# EAGLE design CCM0006 (EAGLE 6.5.0)
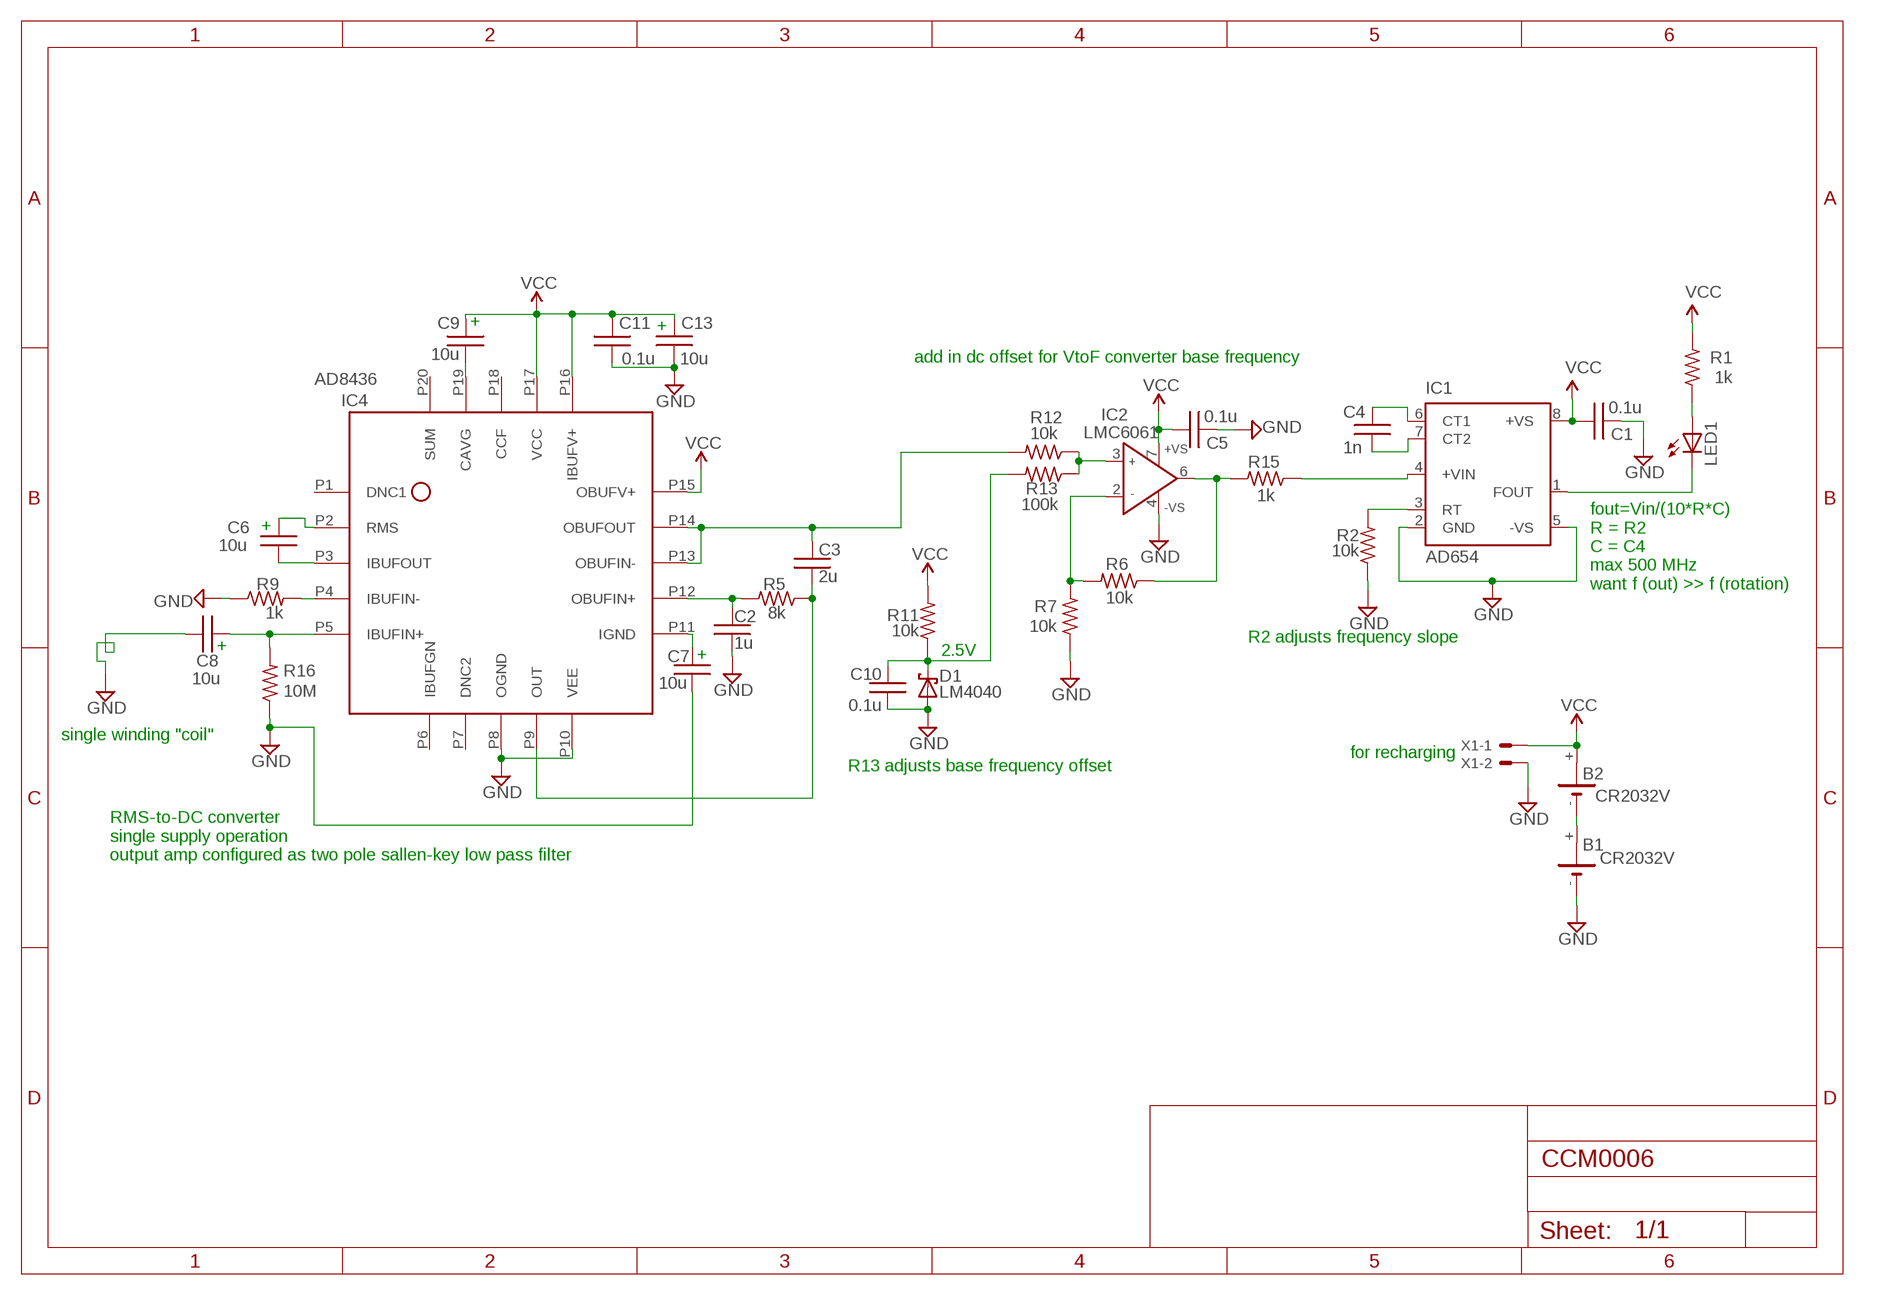
[diagram p0: schematic, sheet 1]

## Parts
B1  CR2032V  [CR2032V]
B2  CR2032V  [CR2032V]
C1  0.1u  CAPACITOR0402  [0402]
C2  1u  CAPACITOR0402  [0402]
C3  2u  CAPACITOR0402  [0402]
C4  1n  CAPACITOR0402  [0402]
C5  0.1u  CAPACITOR0402  [0402]
C6  10u  CAPACITOR0805  [0805]
C7  10u  CAPACITOR0805  [0805]
C8  10u  CAPACITOR0805  [0805]
C9  10u  CAPACITOR0805  [0805]
C10  0.1u  CAPACITOR0402  [0402]
C11  0.1u  CAPACITOR0402  [0402]
C13  10u  CAPACITOR0805  [0805]
D1  LM4040  [SOT23]
IC1  AD654  [SO08]
IC2  LMC6061  AD820R  [SO8]
IC4  AD8436  [CP-20-10]
LED1  LED3MM  [LED3MM]
R1  1k  RESISTOR0402  [0402]
R2  10k  RESISTOR0402  [0402]
R5  8k  RESISTOR0402  [0402]
R6  10k  RESISTOR0402  [0402]
R7  10k  RESISTOR0402  [0402]
R9  1k  RESISTOR0402  [0402]
R11  10k  RESISTOR0402  [0402]
R12  10k  RESISTOR0402  [0402]
R13  100k  RESISTOR0402  [0402]
R15  1k  RESISTOR0402  [0402]
R16  10M  RESISTOR0402  [0402]
X1  22-23-2021  [22-23-2021]

## Nets
AGND: B1.- C1.2 C2.1 C5.2 C7.1 C8.1 C10.2 C11.2 C13.1 D1.2(A) IC1.2(GND) IC1.5(-VS) IC2.4(-VS) IC4.P8(OGND) IC4.P10(VEE) R2.1 R7.1 R9.1 R16.1 X1.2 ; supply symbol labelled GND
N$1: LED1.A R1.1
N$2: IC1.1(FOUT) LED1.K(C)
N$3: IC1.3(RT) R2.2
N$4: C4.2 IC1.6(CT1)
N$5: C4.1 IC1.7(CT2)
N$6: C3.1 IC4.P13(OBUFIN-) IC4.P14(OBUFOUT) R12.2
N$8: C7.2 IC4.P11(IGND)
N$9: C2.2 IC4.P12(OBUFIN+) R5.2
N$10: IC1.4(+VIN) R15.1
N$11: C10.1 D1.1(C) R11.1 R13.2
N$12: C3.2 IC4.P9(OUT) R5.1
N$13: IC2.2(IN-) R6.2 R7.2
N$15: C6.1 IC4.P3(IBUFOUT)
N$17: IC2.3(IN+) R12.1 R13.1
N$18: IC2.6(OUT) R6.1 R15.2
N$20: B1.+ B2.-
N$22: C8.2 IC4.P5(IBUFIN+) R16.2
N$23: IC4.P4(IBUFIN-) R9.2
N$24: C9.2 IC4.P19(CAVG)
RMS: C6.2 IC4.P2(RMS)
VCC: B2.+ C1.1 C5.1 C9.1 C11.1 C13.2 IC1.8(+VS) IC2.7(+VS) IC4.P15(OBUFV+) IC4.P16(IBUFV+) IC4.P17(VCC) R1.2 R11.2 X1.1
Unconnected: B1.+@1(+) B2.+@1(+) IC4.P1(DNC1) IC4.P6(IBUFGN) IC4.P7(DNC2) IC4.P18(CCF) IC4.P20(SUM)

## Notes on the sheet
- + | +
- add in dc offset for VtoF converter base frequency
- +
- fout=Vin/(10*R*C)
  R = R2
  C = C4
  max 500 MHz
  want f (out) >> f (rotation)
- R2 adjusts frequency slope
- + | 2.5V
- +
- single winding "coil"
- for recharging
- R13 adjusts base frequency offset
- RMS-to-DC converter
  single supply operation
  output amp configured as two pole sallen-key low pass filter

## Library data of the parts
B1 B2 = battery:CR2032V: LI BATTERY Varta
C1-C11 C13 = ic:CAPACITOR
D1 = noah:LM4040: LM4040 Reference Zener Diode
IC1 = noah:AD654: Low Cost Monolithic Voltage-to-Frequency Converter
IC2 = analog-devices:AD820: Single-Supply, Rail-to-Rail, Low Power, FET Input Op Amp Source: http://www.analog.com/static/imported-files/data_sheets/AD820.pdf; OC_FARNELL: 1838867; OC_NEWARK: unknown
IC4 = noah:AD8436
LED1 = led:LED: LED OSRAM: - CHIPLED LG R971, LG N971, LY N971, LG Q971, LY Q971, LO R971, LY R971 LH N974, LH R974 LS Q976, LO Q976, LY Q976 LO Q996 - Hyper CHIPLED LW Q18S LB Q993, LB Q99A, LB R99A - SideLED LS A670, LO A670, LY A670, LG A670, LP A670 LB A673, LV A673, LT A673, LW A673 LH A674 LY A675 LS A676, LA A676, LO A676, LY A676, LW A676 LS A679, LY A679, LG A679 - Hyper Micro SIDELED® LS Y876, LA Y876, LO Y876, LY Y876 LT Y87S - SmartLED LW L88C, LW L88S LB L89C, LB L89S, LG L890 LS L89K, LO L89K, LY L89K LS L896, LA L896, LO L896, LY L896 - TOPLED LS T670, LO T670, LY T670, LG T670, LP T670 LSG T670, LSP T670, LSY T670, LOP T670, LYG T670 LG T671, LOG T671, LSG T671 LB T673, LV T673, LT T673, LW T673 LH T674 LS T676, LA T676, LO T676, LY T676, LB T676, LH T676, LSB T676, LW T676 LB T67C, LV T67C, LT T67C, LS T67K, LO T67K, LY T67K, LW E67C LS E67B, LA E67B, LO E67B, LY E67B, LB E67C, LV E67C, LT E67C LW T67C LS T679, LY T679, LG T679 LS T770, LO T770, LY T770, LG T770, LP T770 LB T773, LV T773, LT T773, LW T773 LH T774 LS E675, LA E675, LY E675, LS T675 LS T776, LA T776, LO T776, LY T776, LB T776 LHGB T686 LT T68C, LB T68C - Hyper Mini TOPLED® LB M676 - Mini TOPLED Santana® LG M470 LS M47K, LO M47K, LY M47K Source: http://www.osram.convergy.de LUXEON: - LUMILED® LXK2-PW12-R00, LXK2-PW12-S00, LXK2-PW14-U00, LXK2-PW14-V00 LXK2-PM12-R00, LXK2-PM12-S00, LXK2-PM14-U00 LXK2-PE12-Q00, LXK2-PE12-R00, LXK2-PE12-S00, LXK2-PE14-T00, LXK2-PE14-U00 LXK2-PB12-K00, LXK2-PB12-L00, LXK2-PB12-M00, LXK2-PB14-N00, LXK2-PB14-P00, LXK2-PB14-Q00 LXK2-PR12-L00, LXK2-PR12-M00, LXK2-PR14-Q00, LXK2-PR14-R00 LXK2-PD12-Q00, LXK2-PD12-R00, LXK2-PD12-S00 LXK2-PH12-R00, LXK2-PH12-S00 LXK2-PL12-P00, LXK2-PL12-Q00, LXK2-PL12-R00 Source: www.luxeon.com KINGBRIGHT: KA-3528ASYC Source: www.kingbright.com
R1 R2 R5-R7 R9 R11-R13 R15 R16 = ic:RESISTOR: RESISTOR, American symbol
X1 = con-molex:22-23-2021: .100" (2.54mm) Center Header - 2 Pin; MF: MOLEX; MPN: 22-23-2021; OC_FARNELL: 1462926; OC_NEWARK: 25C3832

## Net classes
1 stripline: width 1.778 mm, clearance 1.27 mm

## Board
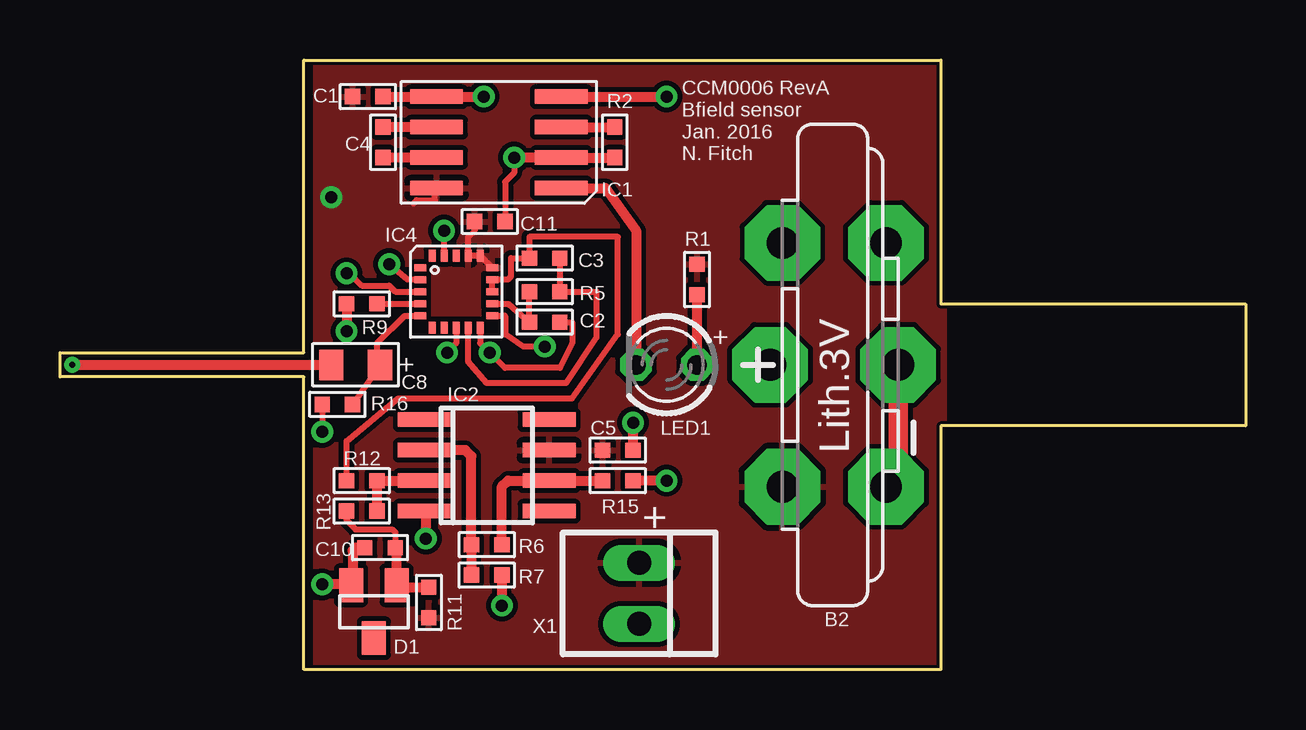
[diagram p1: board, top side]
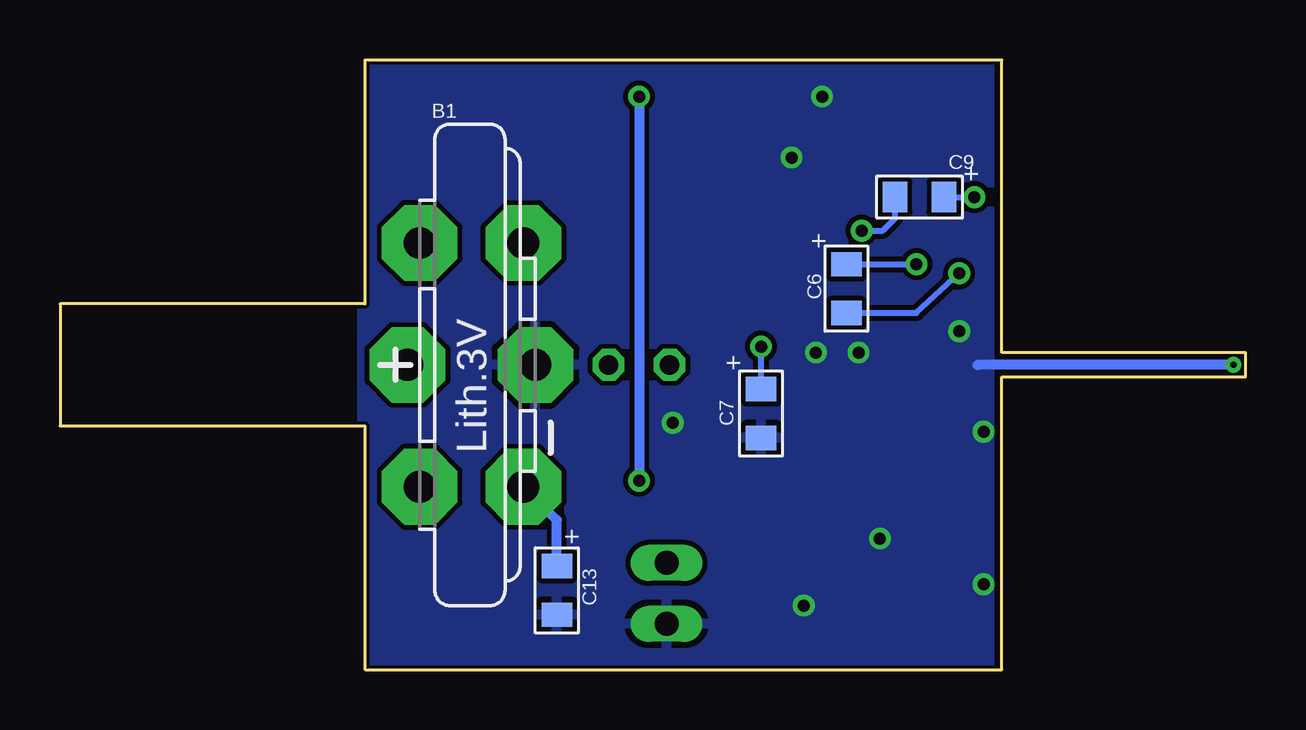
[diagram p2: board, bottom side, seen from below]

Size 49.4 x 25.4 mm. Coordinates in mm from the lower left corner, seen from the top.
Outline: 0,12.19 0,13.21 10.16,13.21 10.16,25.4 36.7,25.4 36.7,15.24 49.4,15.24 49.4,10.16 36.7,10.16 36.7,0 10.16,0 10.16,12.19 0,12.19
Copper layers (1*16): Top 0.035mm / dielectric 1.5mm / Bottom 0.035mm
Design rules "default *": minimum track width 10mil, minimum drill 10mil, track to track 8mil, track to pad 8mil, pad to pad 6mil, via to via 8mil, smd to smd 6mil, copper to edge 5mil, drill to drill 5mil, minimum pad ring 10mil, minimum via ring 8mil, stop-mask expansion 4mil, vias tented up to drill 0mil, thermal gap 10mil

### Footprints (pad centres in the part's own frame; a part is rotated, then mirrored left to right if it is on the bottom)
CR2032V = drill 1.321 pad 3.15 octagon: + -2.54,-5.08; +@1 -2.54,5.08; - 2.286,0
0402 = smd 0.635 x 0.635: 1 -0.635,0; 2 0.635,0
0805 = smd 1.016 x 1.27: 1 -1.016,0; 2 1.016,0
SOT23 = smd 1 x 1.4: 1 -0.95,-1.1; 2 0.95,-1.1; 3 0,1.1
SO08 = smd 0.6 x 2.2: 1 -1.905,-2.6; 2 -0.635,-2.6; 3 0.635,-2.6; 4 1.905,-2.6; 5 1.905,2.6; 6 0.635,2.6; 7 -0.635,2.6; 8 -1.905,2.6
SO8 = smd 0.6 x 2.2: 1 -1.905,-2.6; 2 -0.635,-2.6; 3 0.635,-2.6; 4 1.905,-2.6; 5 1.905,2.6; 6 0.635,2.6; 7 -0.635,2.6; 8 -1.905,2.6
CP-20-10 = smd 0.495 x 0.292: P1 -1.5,1; P5 -1.5,-1; P11 1.5,-1; P15 1.5,1 | smd 0.5 x 0.3: P2 -1.5,0.5; P3 -1.5,0; P4 -1.5,-0.5; P12 1.5,-0.5; P13 1.5,0; P14 1.5,0.5 | smd 0.292 x 0.495: P6 -1,-1.5; P10 1,-1.5; P16 1,1.5; P20 -1,1.5 | smd 0.3 x 0.5: P7 -0.5,-1.5; P8 0,-1.5; P9 0.5,-1.5; P17 0.5,1.5; P18 0,1.5; P19 -0.5,1.5
LED3MM = drill 0.813 octagon: A -1.27,0; K 1.27,0
22-23-2021 = drill 1 long: 1 -1.27,0; 2 1.27,0

### Placement (x,y rotation side)
B1  31.88,12.7 0 bottom
B2  32.64,12.7 0 top
C1  12.83,23.88 0 top
C2  20.19,14.48 180 top
C3  20.19,17.14 0 top
C4  13.46,21.97 90 top
C5  23.24,9.14 0 top
C6  16.64,15.88 90 bottom
C7  20.19,10.67 90 bottom
C8  12.32,12.7 0 top
C9  13.59,19.68 180 bottom
C10  13.34,5.08 180 top
C11  17.91,18.67 0 top
C13  28.7,3.3 90 bottom
D1  13.08,2.41 180 top
IC1  18.29,21.97 90 top
IC2  17.78,8.51 270 top
IC4  16.51,15.75 0 top
LED1  25.27,12.7 180 top
R1  26.54,16.26 90 top
R2  23.11,21.97 90 top
R5  20.19,15.75 180 top
R6  17.78,5.21 180 top
R7  17.78,3.94 180 top
R9  12.57,15.24 0 top
R11  15.37,2.79 270 top
R12  12.57,7.87 180 top
R13  12.57,6.6 180 top
R15  23.24,7.87 180 top
R16  11.56,11.05 0 top
X1  24.13,3.17 270 top

### Tracks (layer width: path | path; a pad name or v marks a point on that pad's centre or on a via)
AGND  (via drill 0.25 pad 0.25, 0.5 pad 0.3)
  Top 0.254: R16.1 v10.92,9.91 | 17.53,14.23 IC4.P10 17.51,13.6 v17.91,13.21 18.54,12.57 20.83,12.57 21.34,13.59 21.34,14.48 C2.1 | 12.06,3.68 12.19,3.56 | 12.19,3.57 10.94,3.57 v10.92,3.56 | IC4.P8 16.51,13.59 v16.13,13.21 | v18.92,21.34 18.92,20.7 18.54,20.32 C11.2
  Top 0.406: v0.51,12.7 C8.1 | R9.1 v11.94,14.1 | IC2.4 15.24,6.54 v15.24,5.46 | R7.1 v18.41,2.67 | 12.19,3.56 v10.92,3.56 | C5.2 v23.88,10.29 | R2.1 IC1.2 v18.92,21.34 | v17.65,23.88 IC1.5 C1.2 | C10.2 12.32,5.08 12.19,4.95 12.19,3.57 D1.2
  Bottom 0.406: v0.51,12.7 11.18,12.7
  pour Bottom: 10.67,25.4 36.83,25.4 36.83,-3.3 10.67,-3.3
N$1
  Top 0.406: LED1.A R1.1
N$2
  Top 0.406: LED1.K 24,18.29 22.73,20.07 IC1.1
N$3
  Top 0.406: IC1.3 R2.2
N$4
  Top 0.406: IC1.6 C4.2
N$5
  Top 0.406: IC1.7 C4.1
N$6
  Top 0.254: IC4.P13 IC4.P14 18.67,16.26 18.8,16.38 18.8,17.14 C3.1 19.56,18.03 23.24,18.03 23.24,13.97 21.34,11.3 14.1,11.3 11.94,9.52 R12.2
N$8  (via drill 0.5 pad 0.3)
  Top 0.254: IC4.P11 18.53,14.75 18.54,14.73 18.54,13.97 19.3,13.46 v20.19,13.46
  Bottom 0.254: C7.2 v20.19,13.46
N$9
  Top 0.254: IC4.P12 18.42,15.25 18.67,15.24 C2.2 R5.2
N$10  (via drill 0.5 pad 0.3)
  Top 0.406: IC1.4 v25.27,23.88 | v25.27,7.87 R15.1
  Bottom 0.406: v25.27,23.88 v25.27,7.87
N$11
  Top 0.254: R13.2 11.94,6.22 12.32,5.84 13.84,5.84 13.97,5.71 C10.1
  Top 0.406: R11.1 14.12,3.43 D1.1 14.03,5.15 C10.1
N$12
  Top 0.254: C3.2 R5.1 22.35,15.75 22.35,13.84 21.08,11.94 17.78,11.94 17.02,12.83 IC4.P9
N$13
  Top 0.406: R7.2 R6.2 17.14,8.89 16.89,9.14 IC2.2
N$15  (via drill 0.5 pad 0.3)
  Top 0.254: v11.94,16.51 12.06,16.51 12.57,16 13.72,16 13.97,15.75 IC4.P3
  Bottom 0.254: C6.1 13.72,14.86 v11.94,16.51
N$17
  Top 0.406: R13.1 R12.1 IC2.3
N$18
  Top 0.406: R6.1 18.41,7.62 18.67,7.87 IC2.6 R15.2
N$20
  Top 0.813: B2.- 34.92,8.13 B1.+
N$22
  Top 0.254: R16.2 C8.2 13.21,12.7 13.21,13.59 14.35,14.73 14.99,14.73 IC4.P5
N$23
  Top 0.254: R9.2 13.47,15.25 IC4.P4
N$24  (via drill 0.5 pad 0.3)
  Top 0.254: IC4.P19 v16.01,18.28 v16,18.29
  Bottom 0.254: v16,18.29 15.11,18.29 14.61,18.8 C9.2
RMS  (via drill 0.5 pad 0.3)
  Top 0.254: v13.72,16.89 14.48,16.26 IC4.P2
  Bottom 0.254: C6.2 v13.72,16.89
VCC  (via drill 0.5 pad 0.3)
  Top 0.254: IC4.P15 IC4.P16 IC4.P17 17.01,18.03 17.27,18.29 C11.1 | 14.73,19.43 14.86,19.56 15.62,19.56 15.62,20 IC1.8
  Bottom 0.254: C9.1 v11.3,19.68
  Bottom 0.406: C13.2 28.7,6.22 B2.+
  Bottom 0.61: 30.1,6.6 B2.+
  pour Top: 10.67,25.4 36.83,25.4 36.83,-3.3 10.67,-3.3

### Text on the board
tPlace: +
tNames: CCM0006 RevA / Bfield sensor / Jan. 2016 / N. Fitch | + | +
bNames: + | + | + | +